# EAGLE design solenoid_driver_1_0 (EAGLE 6.6.0)
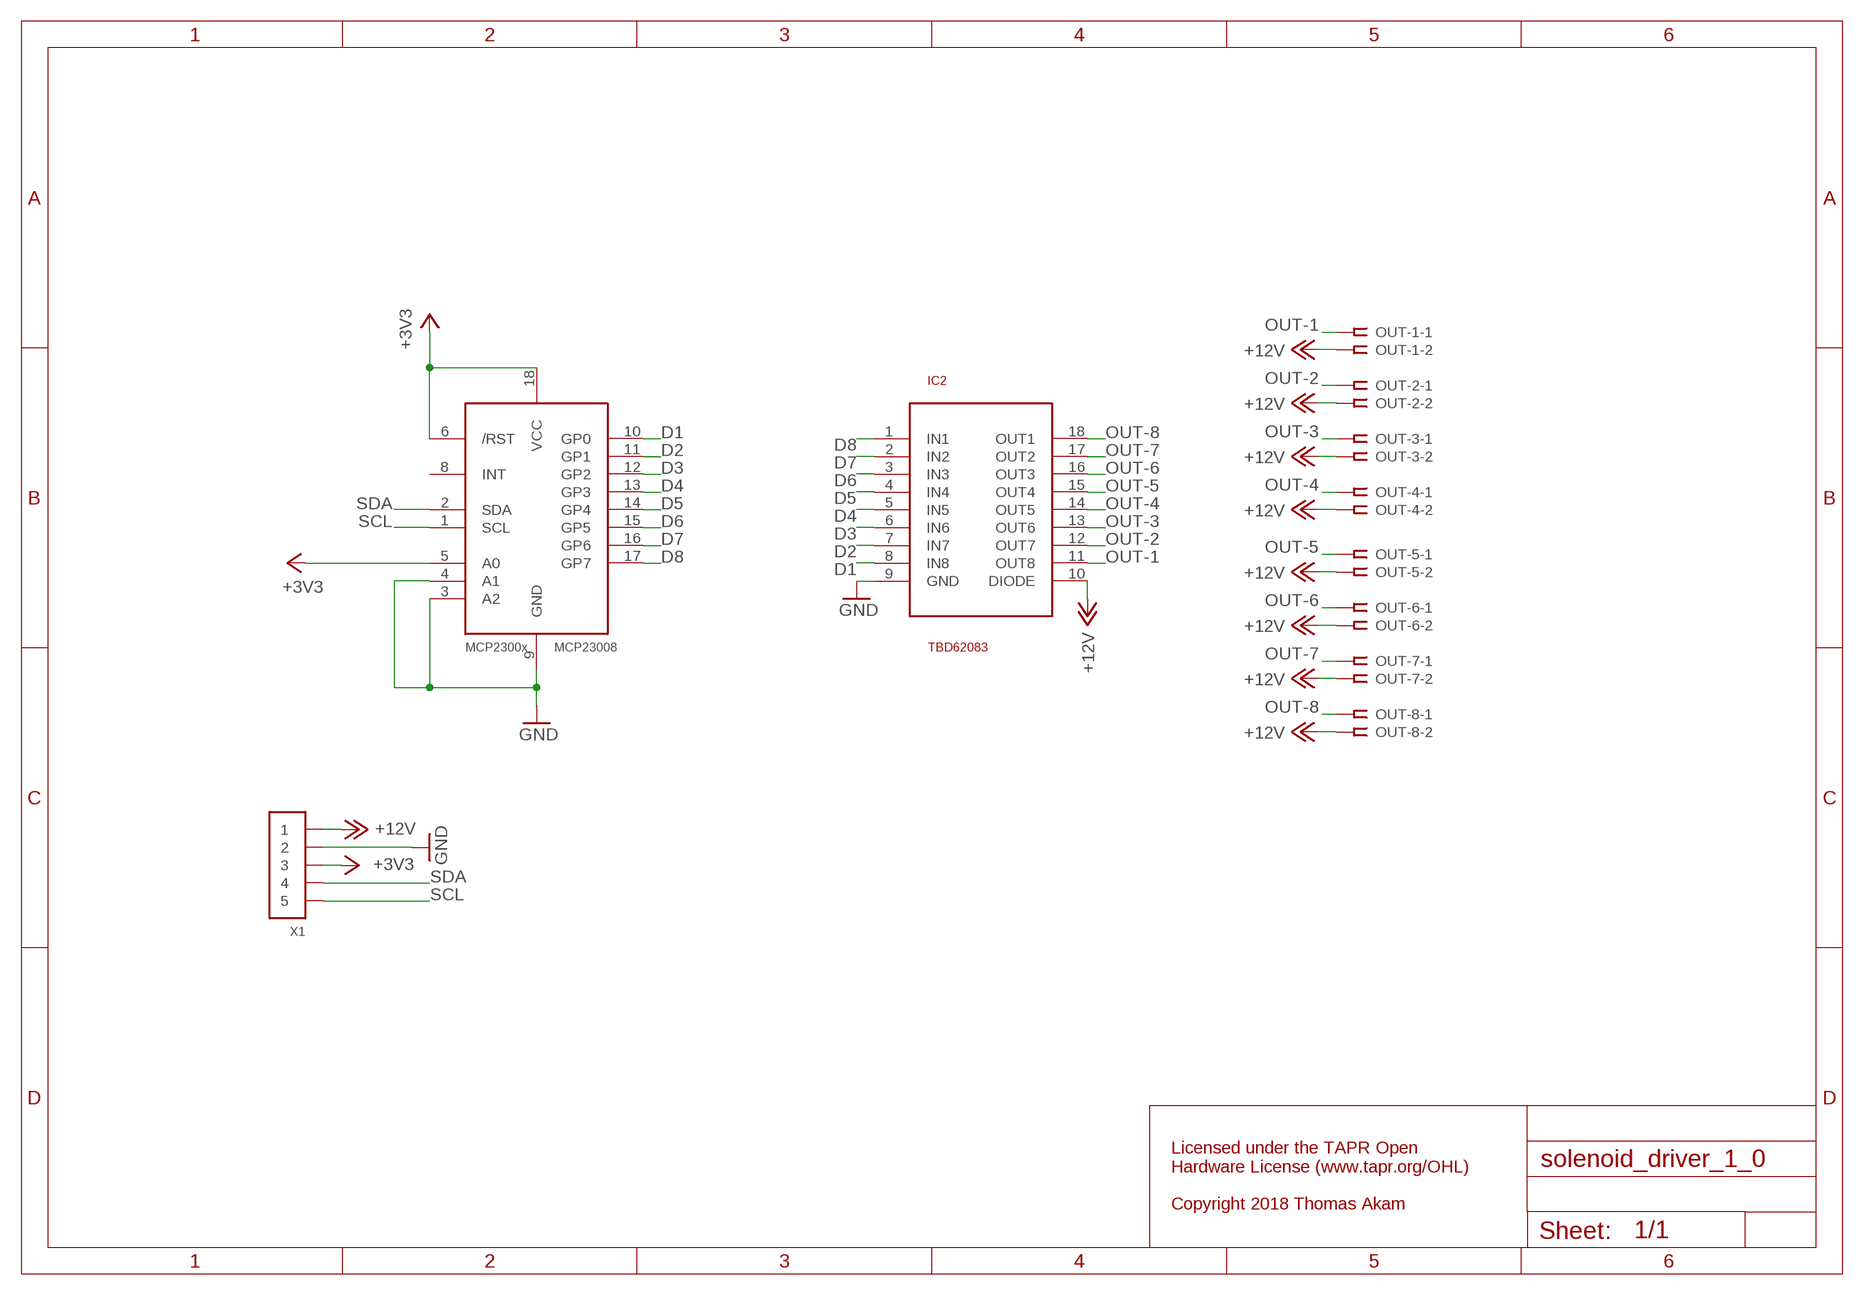
[diagram p0: schematic, sheet 1]

## Parts
IC2  TBD62083  ULN2803  [SO18L]
MCP23008  MCP2300X/SO  [SO18W]
OUT-1  SSW-102-02-S-S-RA  [SSW-102-02-S-S-RA]
OUT-2  SSW-102-02-S-S-RA  [SSW-102-02-S-S-RA]
OUT-3  SSW-102-02-S-S-RA  [SSW-102-02-S-S-RA]
OUT-4  SSW-102-02-S-S-RA  [SSW-102-02-S-S-RA]
OUT-5  SSW-102-02-S-S-RA  [SSW-102-02-S-S-RA]
OUT-6  SSW-102-02-S-S-RA  [SSW-102-02-S-S-RA]
OUT-7  SSW-102-02-S-S-RA  [SSW-102-02-S-S-RA]
OUT-8  SSW-102-02-S-S-RA  [SSW-102-02-S-S-RA]
X1  CONN_5-1-53261  [PB-53261-05]

## Nets
+3V3: MCP23008.5(A0) MCP23008.6(/RST) MCP23008.18(VCC) X1.3
+12V: IC2.10(DIODE) OUT-1.2 OUT-2.2 OUT-3.2 OUT-4.2 OUT-5.2 OUT-6.2 OUT-7.2 OUT-8.2 X1.1
D1: IC2.8(IN8) MCP23008.10(GP0)
D2: IC2.7(IN7) MCP23008.11(GP1)
D3: IC2.6(IN6) MCP23008.12(GP2)
D4: IC2.5(IN5) MCP23008.13(GP3)
D5: IC2.4(IN4) MCP23008.14(GP4)
D6: IC2.3(IN3) MCP23008.15(GP5)
D7: IC2.2(IN2) MCP23008.16(GP6)
D8: IC2.1(IN1) MCP23008.17(GP7)
GND: IC2.9(GND) MCP23008.3(A2) MCP23008.4(A1) MCP23008.9(GND) X1.2
OUT-1: IC2.11(OUT8) OUT-1.1
OUT-2: IC2.12(OUT7) OUT-2.1
OUT-3: IC2.13(OUT6) OUT-3.1
OUT-4: IC2.14(OUT5) OUT-4.1
OUT-5: IC2.15(OUT4) OUT-5.1
OUT-6: IC2.16(OUT3) OUT-6.1
OUT-7: IC2.17(OUT2) OUT-7.1
OUT-8: IC2.18(OUT1) OUT-8.1
SCL: MCP23008.1(SCL) X1.5
SDA: MCP23008.2(SDA) X1.4
Unconnected: MCP23008.8(INT)

## Notes on the sheet
- Licensed under the TAPR Open
  Hardware License (www.tapr.org/OHL)
  
  Copyright 2018 Thomas Akam

## Library data of the parts
IC2 = uln2803:ULN2803
MCP23008 = adafruit:MCP2300X: MCP23008 Inexpensive i2c i/o expander - 8 general purpose i/o pins with optional pullups
OUT-1-OUT-8 = con-samtec:SSW-102-02-S-S: THROUGH-HOLE .025" SQ POST SOCKET Source: Samtec SSW.pdf; MPN: SSW-102-02-S-S-RA; OC_FARNELL: unknown; OC_NEWARK: 11P9352
X1 = pel_molex:CONN_5-1

## Board
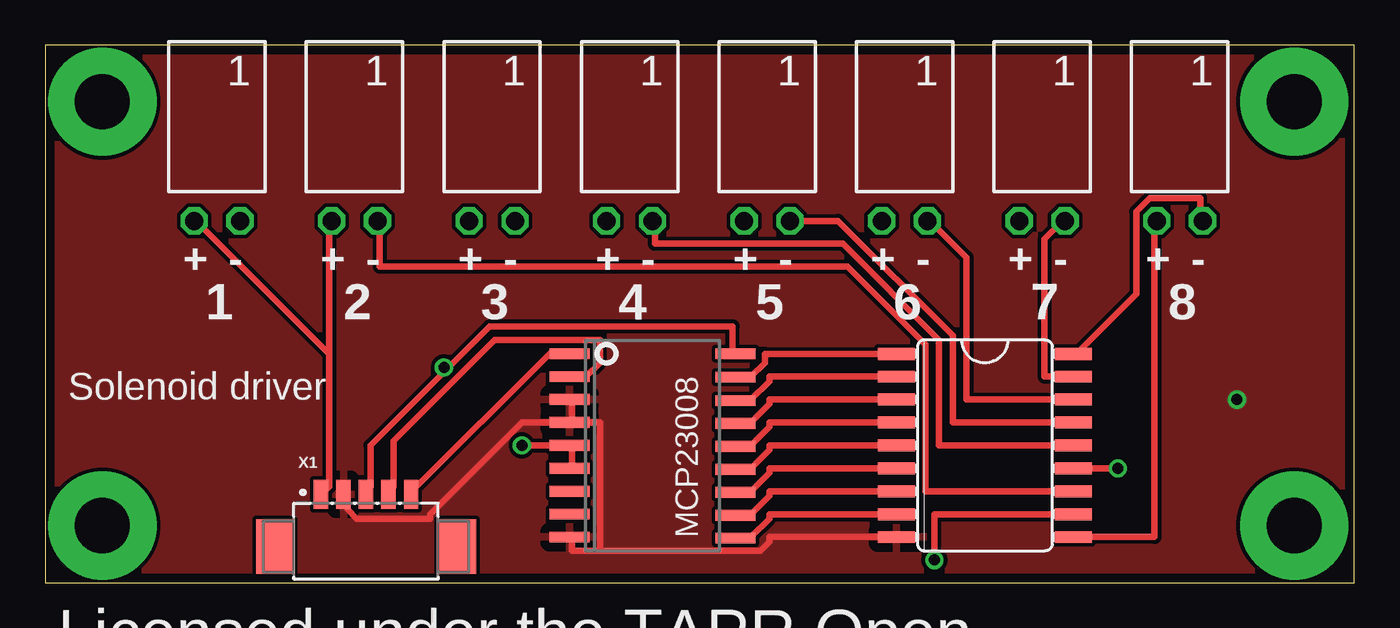
[diagram p1: board, top side]
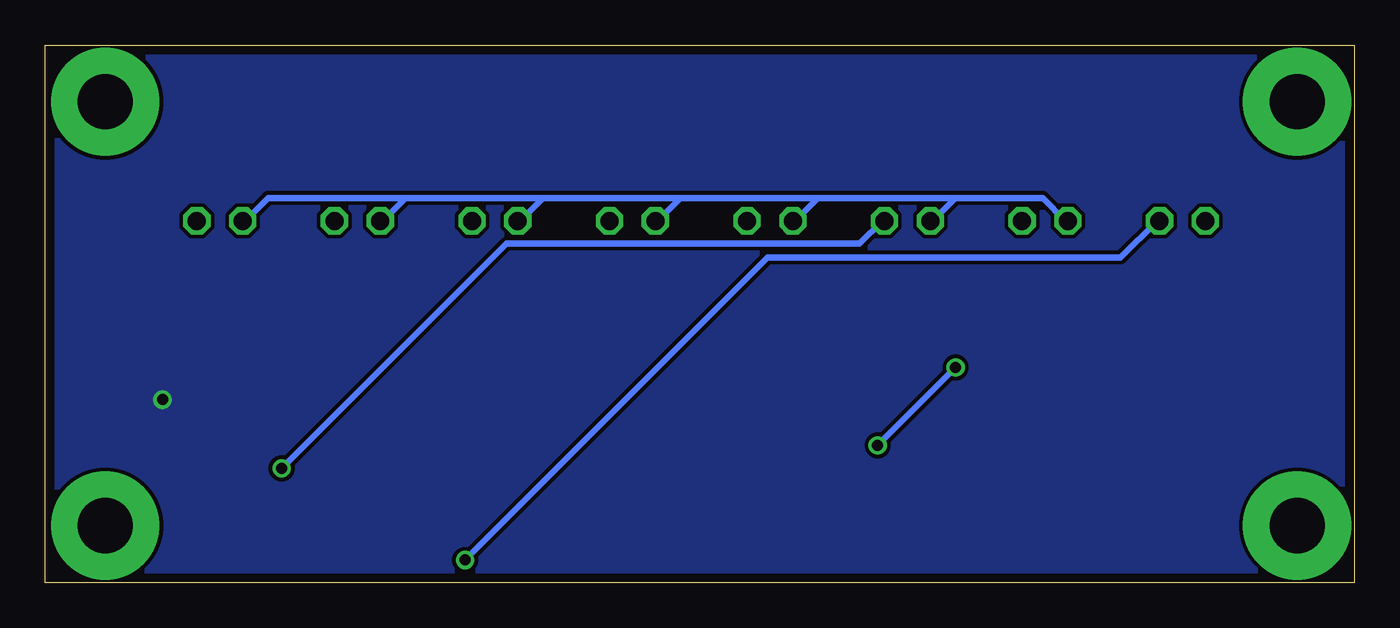
[diagram p2: board, bottom side, seen from below]

Size 72.55 x 29.81 mm. Coordinates in mm from the lower left corner, seen from the top.
Outline: 0,0 72.55,0 72.55,29.81 0,29.81 0,0
Copper layers (1*16): Top 0.035mm / dielectric 1.5mm / Bottom 0.035mm
Design rules "default *": minimum track width 14mil, minimum drill 24mil, track to track 8mil, track to pad 8mil, pad to pad 8mil, via to via 8mil, smd to smd 8mil, copper to edge 20mil, drill to drill 8mil, minimum pad ring 10mil, minimum via ring 8mil, stop-mask expansion 4mil, vias tented up to drill 0mil, thermal gap 20mil
vRestrict: area 48.3,1.9 to 55.9,13.3; area 29.8,1.9 to 37.5,13.3; area 12.1,0 to 23.5,5.7; area 6.3,14 to 66,19.1; area 0.6,9.5 to 21,12.1

### Footprints (pad centres in the part's own frame; a part is rotated, then mirrored left to right if it is on the bottom)
SO18L = smd 0.66 x 2.032: 1 -5.08,-4.902; 2 -3.81,-4.902; 3 -2.54,-4.902; 4 -1.27,-4.902; 5 0,-4.902; 6 1.27,-4.902; 7 2.54,-4.902; 8 3.81,-4.902; 9 5.08,-4.902; 10 5.08,4.902; 11 3.81,4.902; 12 2.54,4.902; 13 1.27,4.902; 14 0,4.902; 15 -1.27,4.902; 16 -2.54,4.902; 17 -3.81,4.902; 18 -5.08,4.902
SO18W = smd 0.6 x 2.2: 1 -4.445,-4.6; 2 -3.175,-4.6; 3 -1.905,-4.6; 4 -0.635,-4.6; 5 0.635,-4.6; 6 1.905,-4.6; 7 3.175,-4.6; 8 4.445,-4.6; 9 5.715,-4.6; 10 5.775,4.6; 11 4.505,4.6; 12 3.235,4.6; 13 1.965,4.6; 14 0.695,4.6; 15 -0.575,4.6; 16 -1.845,4.6; 17 -3.145,4.6; 18 -4.445,4.6
SSW-102-02-S-S-RA = drill 1 pad 1.5 octagon: 1 -1.27,1.524; 2 1.27,1.524
PB-53261-05 = smd 0.8 x 1.6: 1 -2.5,1.1; 2 -1.25,1.1; 3 0,1.1; 4 1.25,1.1; 5 2.5,1.1 | smd 2.1 x 3: MNT1 -5.05,-1.8; MNT2 5.05,-1.8

### Placement (x,y rotation side)
IC2  52.07,7.62 270 top
MCP23008  33.66,8.26 270 top
OUT-1  9.53,21.59 180 top
OUT-2  17.14,21.59 180 top
OUT-3  24.77,21.59 180 top
OUT-4  32.38,21.59 180 top
OUT-5  40.01,21.59 180 top
OUT-6  47.62,21.59 180 top
OUT-7  55.24,21.59 180 top
OUT-8  62.87,21.59 180 top
X1  17.78,3.81 0 top

### Tracks (layer width: path | path; a pad name or v marks a point on that pad's centre or on a via)
+3V3  (via drill 0.61)
  Top 0.356: MCP23008.6 29.21,6.35 29.21,7.62 MCP23008.5 v26.42,7.62 | 22.35,11.94 24.64,14.22 38.1,14.22 38.1,12.7 MCP23008.18 | 22.35,11.94 18.03,7.62 18.03,5.33 17.78,5.08 X1.3 | 22.35,11.94 v22.1,11.94
  Bottom 0.356: v22.1,11.94 v26.42,7.62
+12V
  Top 0.356: IC2.10 61.47,2.54 61.47,20.07 OUT-8.2 | 15.75,12.7 15.75,20.07 OUT-2.2 | 15.75,12.7 15.75,5.33 15.49,5.08 X1.1 | 15.75,12.7 8.38,20.07 OUT-1.2
  Bottom 0.356: 22.1,21.34 23.37,20.07 OUT-3.2 | 22.1,21.34 17.27,21.34 16,20.07 OUT-2.2 | 29.72,21.34 30.99,20.07 OUT-4.2 | 22.1,21.34 29.72,21.34 | 37.34,21.34 38.61,20.07 OUT-5.2 | 29.72,21.34 37.34,21.34 | 44.96,21.34 46.23,20.07 OUT-6.2 | 37.34,21.34 44.96,21.34 | 52.58,21.34 53.85,20.07 OUT-7.2 | 44.96,21.34 52.58,21.34 | 52.58,21.34 60.2,21.34 61.47,20.07 OUT-8.2
D1
  Top 0.356: IC2.8 40.13,3.81 40.13,3.56 39.12,2.54 38.35,2.54 MCP23008.10
D2
  Top 0.356: IC2.7 40.13,5.08 40.13,4.83 39.12,3.81 38.35,3.81 MCP23008.11
D3
  Top 0.356: IC2.6 40.13,6.35 40.13,6.1 39.12,5.08 38.35,5.08 MCP23008.12
D4
  Top 0.356: IC2.5 40.13,7.62 40.13,7.37 39.12,6.35 38.35,6.35 MCP23008.13
D5
  Top 0.356: IC2.4 40.13,8.89 40.13,8.64 39.12,7.62 38.35,7.62 MCP23008.14
D6
  Top 0.356: IC2.3 40.13,10.16 40.13,9.91 39.12,8.89 38.35,8.89 MCP23008.15
D7
  Top 0.356: IC2.2 40.13,11.43 40.13,11.18 39.12,10.16 38.35,10.16 MCP23008.16
D8
  Top 0.356: IC2.1 39.88,12.7 39.88,12.19 39.12,11.43 38.35,11.43 MCP23008.17
GND  (via drill 0.61)
  Top 0.356: X1.2 16.76,4.83 16.76,4.06 17.27,3.56 21.34,3.56 21.34,3.81 26.42,8.89 MCP23008.4 29.21,8.89 | 29.21,8.89 29.21,10.16 MCP23008.3 | IC2.9 40.13,2.54 40.13,2.29 39.62,1.78 30.73,1.78 | 30.73,1.78 29.21,1.78 29.21,2.54 MCP23008.9 | 29.21,8.89 30.73,8.89 30.73,1.78
  other vias: 66.04,10.16
  pour Bottom: 0,0 0,29.84 72.39,29.84 72.39,0
  pour Top: 0,0 72.39,0 72.39,29.84 0,29.84
N$1  (via drill 3.05 pad 6)
  other vias: 69.22,26.67
N$2  (via drill 3.05 pad 6)
  other vias: 3.17,3.17
N$3  (via drill 3.05 pad 6)
  other vias: 3.17,26.67
N$4  (via drill 3.05 pad 6)
  other vias: 69.22,3.17
OUT-1  (via drill 0.61)
  Top 0.356: IC2.11 49.28,3.81 v49.28,1.27
  Bottom 0.356: v49.28,1.27 32.51,18.03 12.95,18.03 10.92,20.07 OUT-1.1
OUT-2
  Top 0.356: IC2.12 48.77,5.08 48.77,13.21 44.45,17.53 18.54,17.53 18.54,20.07 OUT-2.1
OUT-3  (via drill 0.61)
  Top 0.356: v59.44,6.35 IC2.13
  Bottom 0.356: v59.44,6.35 46.99,18.8 27.43,18.8 26.16,20.07 OUT-3.1
OUT-4
  Top 0.356: IC2.14 49.53,7.62 49.53,13.46 44.2,18.8 33.78,18.8 33.78,20.07 OUT-4.1
OUT-5
  Top 0.356: IC2.15 50.29,8.89 50.29,13.72 43.94,20.07 OUT-5.1
OUT-6
  Top 0.356: IC2.16 51.05,10.16 51.05,18.03 49.02,20.07 OUT-6.1
OUT-7
  Top 0.356: IC2.17 55.37,11.43 55.37,19.05 56.39,20.07 OUT-7.1
OUT-8
  Top 0.356: IC2.18 57.15,12.7 60.45,16 60.45,20.57 61.21,21.34 64.01,21.34 64.01,20.07 OUT-8.1
SCL
  Top 0.356: MCP23008.1 27.94,12.7 20.32,5.08 X1.5
SDA
  Top 0.356: MCP23008.2 29.97,11.43 30.73,12.19 30.73,13.46 24.89,13.46 19.3,7.87 19.3,5.33 19.05,5.08 X1.4

### Text on the board
tPlace: Licensed under the TAPR Open / Hardware License (www.tapr.org/OHL) / / Copyright 2018 Thomas Akam
tNames: + | - | + | - | + | - | + | - | + | - | + | - | + | - | + | - | 1 | 2 | 3 | 4 | 5 | 6 | 7 | 8 | Solenoid driver